# EAGLE design large_sense_pcb_a (EAGLE 9.6.2)
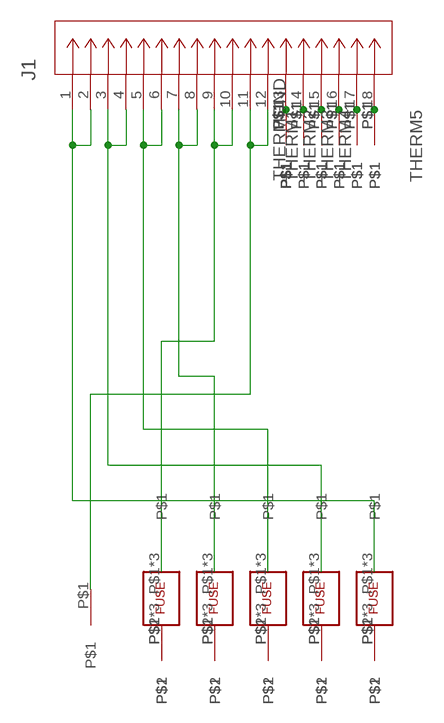
[diagram p0: schematic, sheet 1]

## Parts
J1  DF11-18DP-2DSA(24)  [CON18_2X9_UF_DF11_HIR]
U$1  FUSE  [FUSE_PADS]
U$2  FUSE  [FUSE_PADS]
U$3  FUSE  [FUSE_PADS]
U$4  FUSE  [FUSE_PADS]
U$5  FUSE  [FUSE_PADS]
U$6  BB_CONTACT  [BB_CONTACT]
U$7  BB_CONTACT  [BB_CONTACT]
U$8  BB_CONTACT  [BB_CONTACT]
U$9  BB_CONTACT  [BB_CONTACT]
U$10  BB_CONTACT  [BB_CONTACT]
U$11  BB_CONTACT  [BB_CONTACT]
U$12  THERM_PIN  [THERM_PIN]
U$13  THERM_PIN  [THERM_PIN]
U$14  THERM_PIN  [THERM_PIN]
U$15  THERM_PIN  [THERM_PIN]
U$16  THERM_PIN  [THERM_PIN]
U$17  THERM_PIN  [THERM_PIN]
U$18  THERM_PIN  [THERM_PIN]
U$19  THERM_PIN  [THERM_PIN]
U$20  THERM_PIN  [THERM_PIN]
U$21  THERM_PIN  [THERM_PIN]
U$22  THERM_PIN  [THERM_PIN]
U$23  THERM_PIN  [THERM_PIN]
U$24  THERM_PIN  [THERM_PIN]
U$25  THERM_PIN  [THERM_PIN]
U$26  THERM_PIN  [THERM_PIN]
U$27  THERM_PIN  [THERM_PIN]
U$28  THERM_PIN  [THERM_PIN]
U$29  THERM_PIN  [THERM_PIN]
U$30  THERM_PIN  [THERM_PIN]
U$31  THERM_PIN  [THERM_PIN]

## Nets
N$1: J1.11 J1.12 U$11.P$1
N$2: U$1.P$2 U$1.P$4 U$1.P$6 U$6.P$1
N$3: J1.1 J1.2 U$5.P$1 U$5.P$3 U$5.P$5
N$4: U$2.P$2 U$2.P$4 U$2.P$6 U$7.P$1
N$5: U$5.P$2 U$5.P$4 U$5.P$6 U$10.P$1
N$6: U$3.P$2 U$3.P$4 U$3.P$6 U$8.P$1
N$7: J1.9 J1.10 U$1.P$1 U$1.P$3 U$1.P$5
N$8: U$4.P$2 U$4.P$4 U$4.P$6 U$9.P$1
N$9: J1.7 J1.8 U$2.P$1 U$2.P$3 U$2.P$5
N$10: J1.5 J1.6 U$3.P$1 U$3.P$3 U$3.P$5
N$11: J1.3 J1.4 U$4.P$1 U$4.P$3 U$4.P$5
THERM1: J1.14 U$22.P$1 U$23.P$1
THERM2: J1.15 U$24.P$1 U$25.P$1
THERM3: J1.16 U$26.P$1 U$27.P$1
THERM4: J1.17 U$28.P$1 U$29.P$1
THERM5: J1.18 U$30.P$1 U$31.P$1
THERMGND: J1.13 U$12.P$1 U$13.P$1 U$14.P$1 U$15.P$1 U$16.P$1 U$17.P$1 U$18.P$1 U$19.P$1 U$20.P$1 U$21.P$1

## Library data of the parts
J1 = sense_pcb_components:DF11-18DP-2DSA(24); COPYRIGHT: Copyright (C) 2023 Ultra Librarian. All rights reserved.; MANUFACTURER_PART_NUMBER: DF11-18DP-2DSA(24); MFR_NAME: Hirose
U$1-U$5 = sense_pcb_components:FUSE
U$6-U$11 = sense_pcb_components:BB_CONTACT
U$12-U$31 = sense_pcb_components:THERM_PIN

## Board
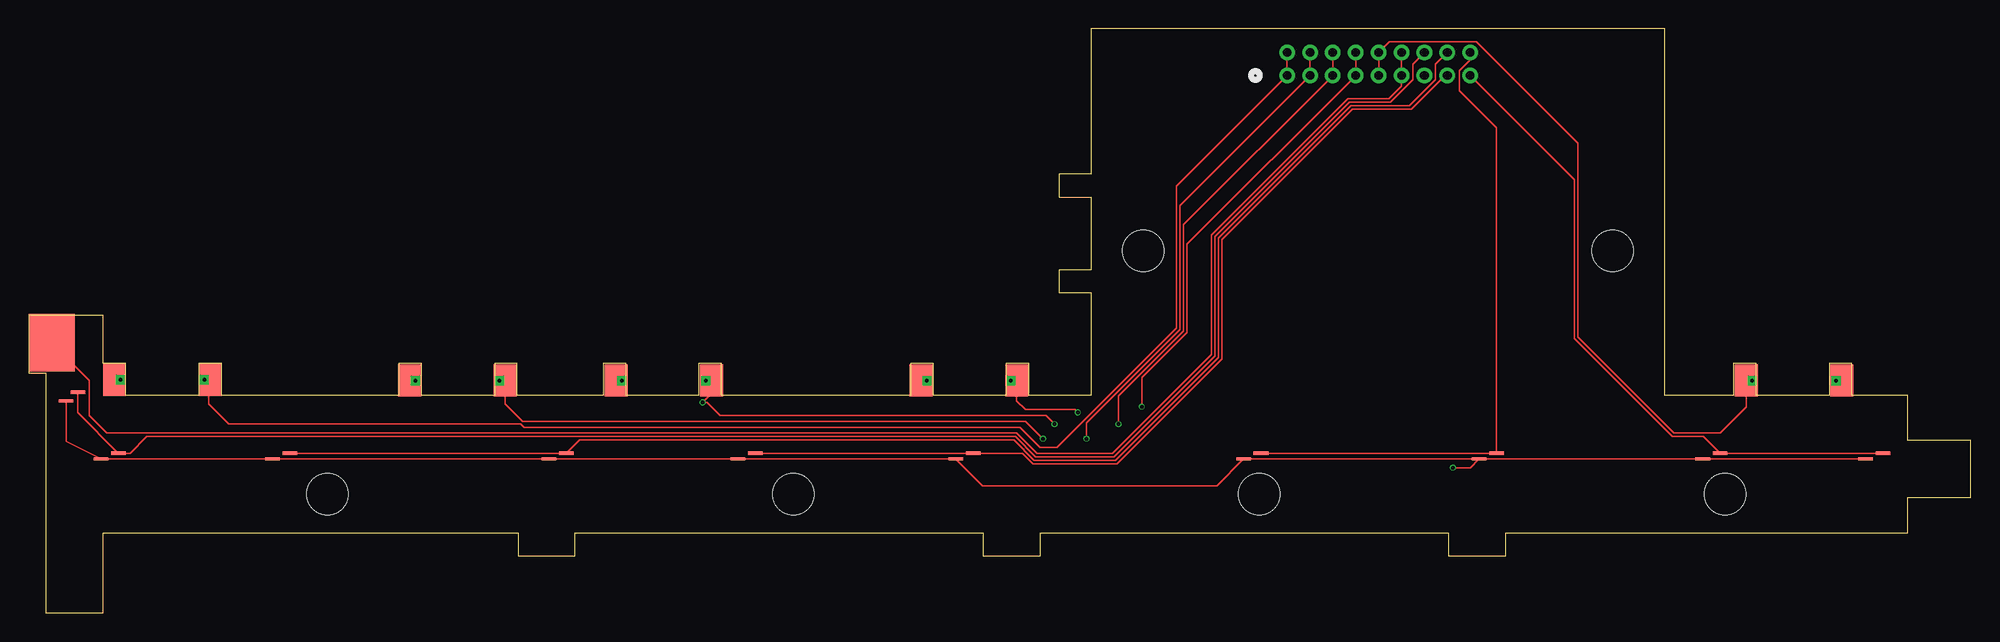
[diagram p1: board, top side]
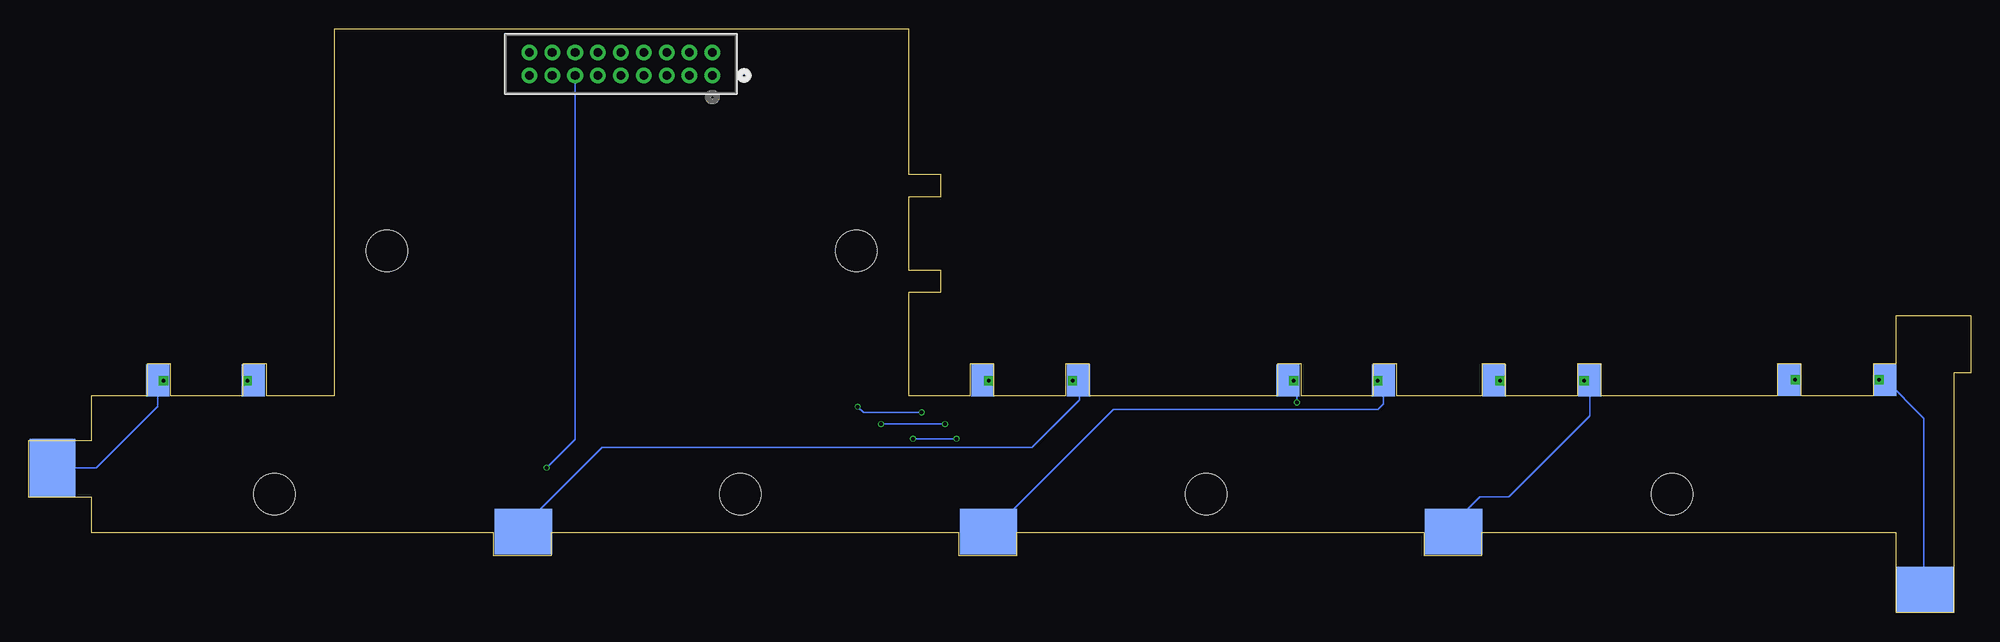
[diagram p2: board, bottom side, seen from below]

Size 169.7 x 51.09 mm. Coordinates in mm from the lower left corner, seen from the top.
Outline: 42.75,7 42.75,5 47.75,5 47.75,7 83.4,7 83.4,5 88.4,5 88.4,7 124.05,7 124.05,5 129.05,5 129.05,7 164.2,7 164.2,10.1 169.7,10.1 169.7,15.1 164.2,15.1 164.2,19 159.31,19 159.31,21.8 157.31,21.8 157.31,19 150.96,19 150.96,21.8 148.96,21.8 148.96,19 142.96,19 142.96,51.09 92.84,51.09 92.84,38.35 90.04,38.35 90.04,36.35 92.84,36.35 92.84,30 90.04,30 90.04,28 92.84,28 92.84,19 87.41,19 87.41,21.8 85.41,21.8 85.41,19 79.06,19 79.06,21.8 77.06,21.8 77.06,19 60.56,19 60.56,21.8 58.56,21.8 58.56,19 52.21,19 52.21,21.8 50.21,21.8 50.21,19 42.7,19 42.7,21.8 40.7,21.8 40.7,19 34.35,19 34.35,21.8 32.35,21.8 32.35,19 16.85,19 16.85,21.8 14.85,21.8 14.85,19 8.5,19 8.5,21.8 6.5,21.8 6.5,26 0,26 0,21 1.5,21 1.5,0 6.5,0 6.5,7 42.75,7
Copper layers (1*16): Top 0.035mm / dielectric 1.6mm / Bottom 0.035mm
Design rules "jlcpcb-2layers": minimum track width 5mil, minimum drill 0.3mm, track to track 5mil, track to pad 5mil, pad to pad 5mil, via to via 5mil, smd to smd 5mil, copper to edge 0.2mm, drill to drill 6mil, minimum pad ring 10mil, minimum via ring 3mil, stop-mask expansion 4mil, vias tented up to drill 0mil, thermal gap 10mil
Holes 3.6 mm at 107.51,10.4 66.81,10.4 26.1,10.4 148.21,10.4 138.4,31.65 97.4,31.65

### Footprints (pad centres in the part's own frame; a part is rotated, then mirrored left to right if it is on the bottom)
CON18_2X9_UF_DF11_HIR = drill 0.762 pad 1.27: 1 0,0; 2 0,2.007; 3 -2.007,0; 4 -2.007,2.007; 5 -3.988,0; 6 -3.988,2.007; 7 -5.994,0; 8 -5.994,2.007; 9 -8.001,0; 10 -8.001,2.007; 11 -10.008,0; 12 -10.008,2.007; 13 -11.989,0; 14 -11.989,2.007; 15 -13.995,0; 16 -13.995,2.007; 17 -16.002,0; 18 -16.002,2.007
FUSE_PADS = smd 2.8 x 2 bottom: P$1 0,0; P$2 0,8.35 | smd 2.8 x 2: P$3 0,0; P$4 0,8.35 | drill 0.305 square: P$5 0,0.508; P$6 0,7.842
BB_CONTACT = smd 5 x 4: P$1 0,0
THERM_PIN = smd 0.279 x 1.27: P$1 0,0

### Placement (x,y rotation side)
J1  109.96,46.99 0 bottom
U$1  150.09,20.32 270 top
U$2  86.34,20.32 90 top
U$3  59.67,20.32 90 top
U$4  41.63,20.32 90 top
U$5  15.85,20.4 90 top
U$6  167.62,12.7 270 bottom
U$7  126.47,7.11 0 bottom
U$8  85.83,7.11 0 bottom
U$9  45.19,7.11 0 bottom
U$10  4.04,2.03 0 bottom
U$11  2.01,23.62 270 top
U$12  81,13.46 90 top
U$13  146.28,13.46 90 top
U$14  160.5,13.46 90 top
U$15  3.28,18.54 90 top
U$16  106.15,13.46 90 top
U$17  126.72,13.46 90 top
U$18  61.95,13.46 90 top
U$19  45.44,13.46 90 top
U$20  21.31,13.46 90 top
U$21  6.33,13.46 90 top
U$22  7.85,13.97 90 top
U$23  4.29,19.3 90 top
U$24  63.48,13.97 90 top
U$25  82.53,13.97 90 top
U$26  46.97,13.97 90 top
U$27  22.84,13.97 90 top
U$28  147.8,13.97 90 top
U$29  162.03,13.97 90 top
U$30  128.25,13.97 90 top
U$31  107.67,13.97 90 top

### Tracks (layer width: path | path; a pad name or v marks a point on that pad's centre or on a via)
N$1
  Top 0.152: J1.12 J1.11 119.97,46.08 118.85,44.96 115.29,44.96 103.35,33.02 103.35,22.61 94.72,13.97 88.11,13.97 86.34,15.75 6.83,15.75 5.31,17.27 5.31,20.32 U$11.P$1
N$2
  Top 0.152: U$1.P$4 U$1.P$6
  Bottom 0.152: U$6.P$1 163.81,12.7 158.44,18.07 U$1.P$4 U$1.P$6
N$3
  Top 0.152: J1.2 J1.1 100.29,37.32 100.29,24.91 89.86,14.48 88.37,14.48 86.64,16.2 43.28,16.2 42.98,16.51 17.5,16.51 15.72,18.29 15.72,20.27 U$5.P$3 U$5.P$5
  Bottom 0.152: U$5.P$3 U$5.P$5
N$4
  Top 0.152: U$2.P$4 U$2.P$6
  Bottom 0.152: U$7.P$1 126.98,7.11 119.61,14.48 82.05,14.48 77.88,18.64 77.88,20.22 U$2.P$4 U$2.P$6
N$5
  Top 0.152: U$5.P$4 U$5.P$6
  Bottom 0.152: U$10.P$1 4.12,2.11 4.12,17.01 U$5.P$4 U$5.P$6
N$6
  Top 0.152: U$3.P$4 U$3.P$6
  Bottom 0.152: U$8.P$1 85.95,6.99 85.95,6.73 74.91,17.78 51.82,17.78 51.32,18.29 U$3.P$4 U$3.P$6
N$7
  Top 0.152: J1.9 J1.10 118.9,49.94 126.5,49.94 135.36,41.07 135.36,24.13 143.74,15.75 147.8,15.75 150.09,18.03 U$1.P$3 U$1.P$5
  Bottom 0.152: U$1.P$3 U$1.P$5
N$8
  Top 0.152: U$4.P$4 U$4.P$6
  Bottom 0.152: U$9.P$1 45.19,7.87 42.9,10.16 40.36,10.16 33.28,17.24 U$4.P$4 U$4.P$6
N$9  (via drill 0.35)
  Top 0.152: v91.67,17.53 91.42,17.78 87.1,17.78 86.34,18.54 U$2.P$3 U$2.P$5 | v97.26,18.03 97.26,20.58 101.21,24.53 101.21,32.24 J1.7 J1.8
  Bottom 0.152: v91.67,17.53 96.75,17.53 v97.26,18.03 | U$2.P$3 U$2.P$5
N$10  (via drill 0.35)
  Top 0.152: v89.64,16.51 88.88,17.27 60.43,17.27 59.28,18.41 v58.88,18.41 59.67,19.2 U$3.P$3 | v95.23,16.51 95.23,18.98 100.9,24.66 100.9,33.95 J1.5 J1.6
  Bottom 0.152: v89.64,16.51 v95.23,16.51 | v58.88,18.41 58.88,20.04 U$3.P$5 U$3.P$3
N$11  (via drill 0.35)
  Top 0.152: v92.43,15.24 92.43,16.62 100.6,24.78 100.6,35.62 J1.3 J1.4 | v88.62,15.24 87.1,16.76 43.16,16.76 41.63,18.29 U$4.P$3 U$4.P$5
  Bottom 0.152: v88.62,15.24 v92.43,15.24 | U$4.P$3 U$4.P$5
THERM1
  Top 0.152: U$23.P$1 4.29,17.53 U$22.P$1 8.87,13.97 10.34,15.44 86.21,15.44 87.99,13.66 94.84,13.66 103.66,22.48 103.66,32.89 115.42,44.65 118.97,44.65 120.93,46.61 120.93,47.98 J1.14
THERM2
  Top 0.152: U$24.P$1 U$25.P$1 86.82,13.97 87.73,13.06 95.1,13.06 104.27,22.23 104.27,32.64 115.67,44.04 120.81,44.04 123.75,46.99 J1.15
THERM3
  Top 0.152: U$27.P$1 U$26.P$1 48.13,15.14 86.08,15.14 87.86,13.36 94.97,13.36 103.96,22.35 103.96,32.77 115.55,44.35 120.65,44.35 122.91,46.61 122.91,47.95 J1.16
THERM4
  Top 0.152: U$29.P$1 U$28.P$1 146.33,15.44 143.61,15.44 135.05,24 135.05,37.9 J1.17
THERM5
  Top 0.152: U$31.P$1 U$30.P$1 128.25,42.42 125,45.67 125,47.42 125.96,48.39 J1.18
THERMGND  (via drill 0.35)
  Top 0.152: U$15.P$1 3.28,14.99 U$21.P$1 U$20.P$1 U$19.P$1 U$18.P$1 U$12.P$1 83.34,11.12 103.81,11.12 U$16.P$1 U$17.P$1 | U$14.P$1 U$13.P$1 U$17.P$1 | v124.44,12.7 125.96,12.7 U$17.P$1
  Bottom 0.152: v124.44,12.7 121.95,15.19 J1.13